# Altium schematic sheet MainBoard_Box.SchDoc
size A3; SheetNumber: 1; SheetTotal: 1
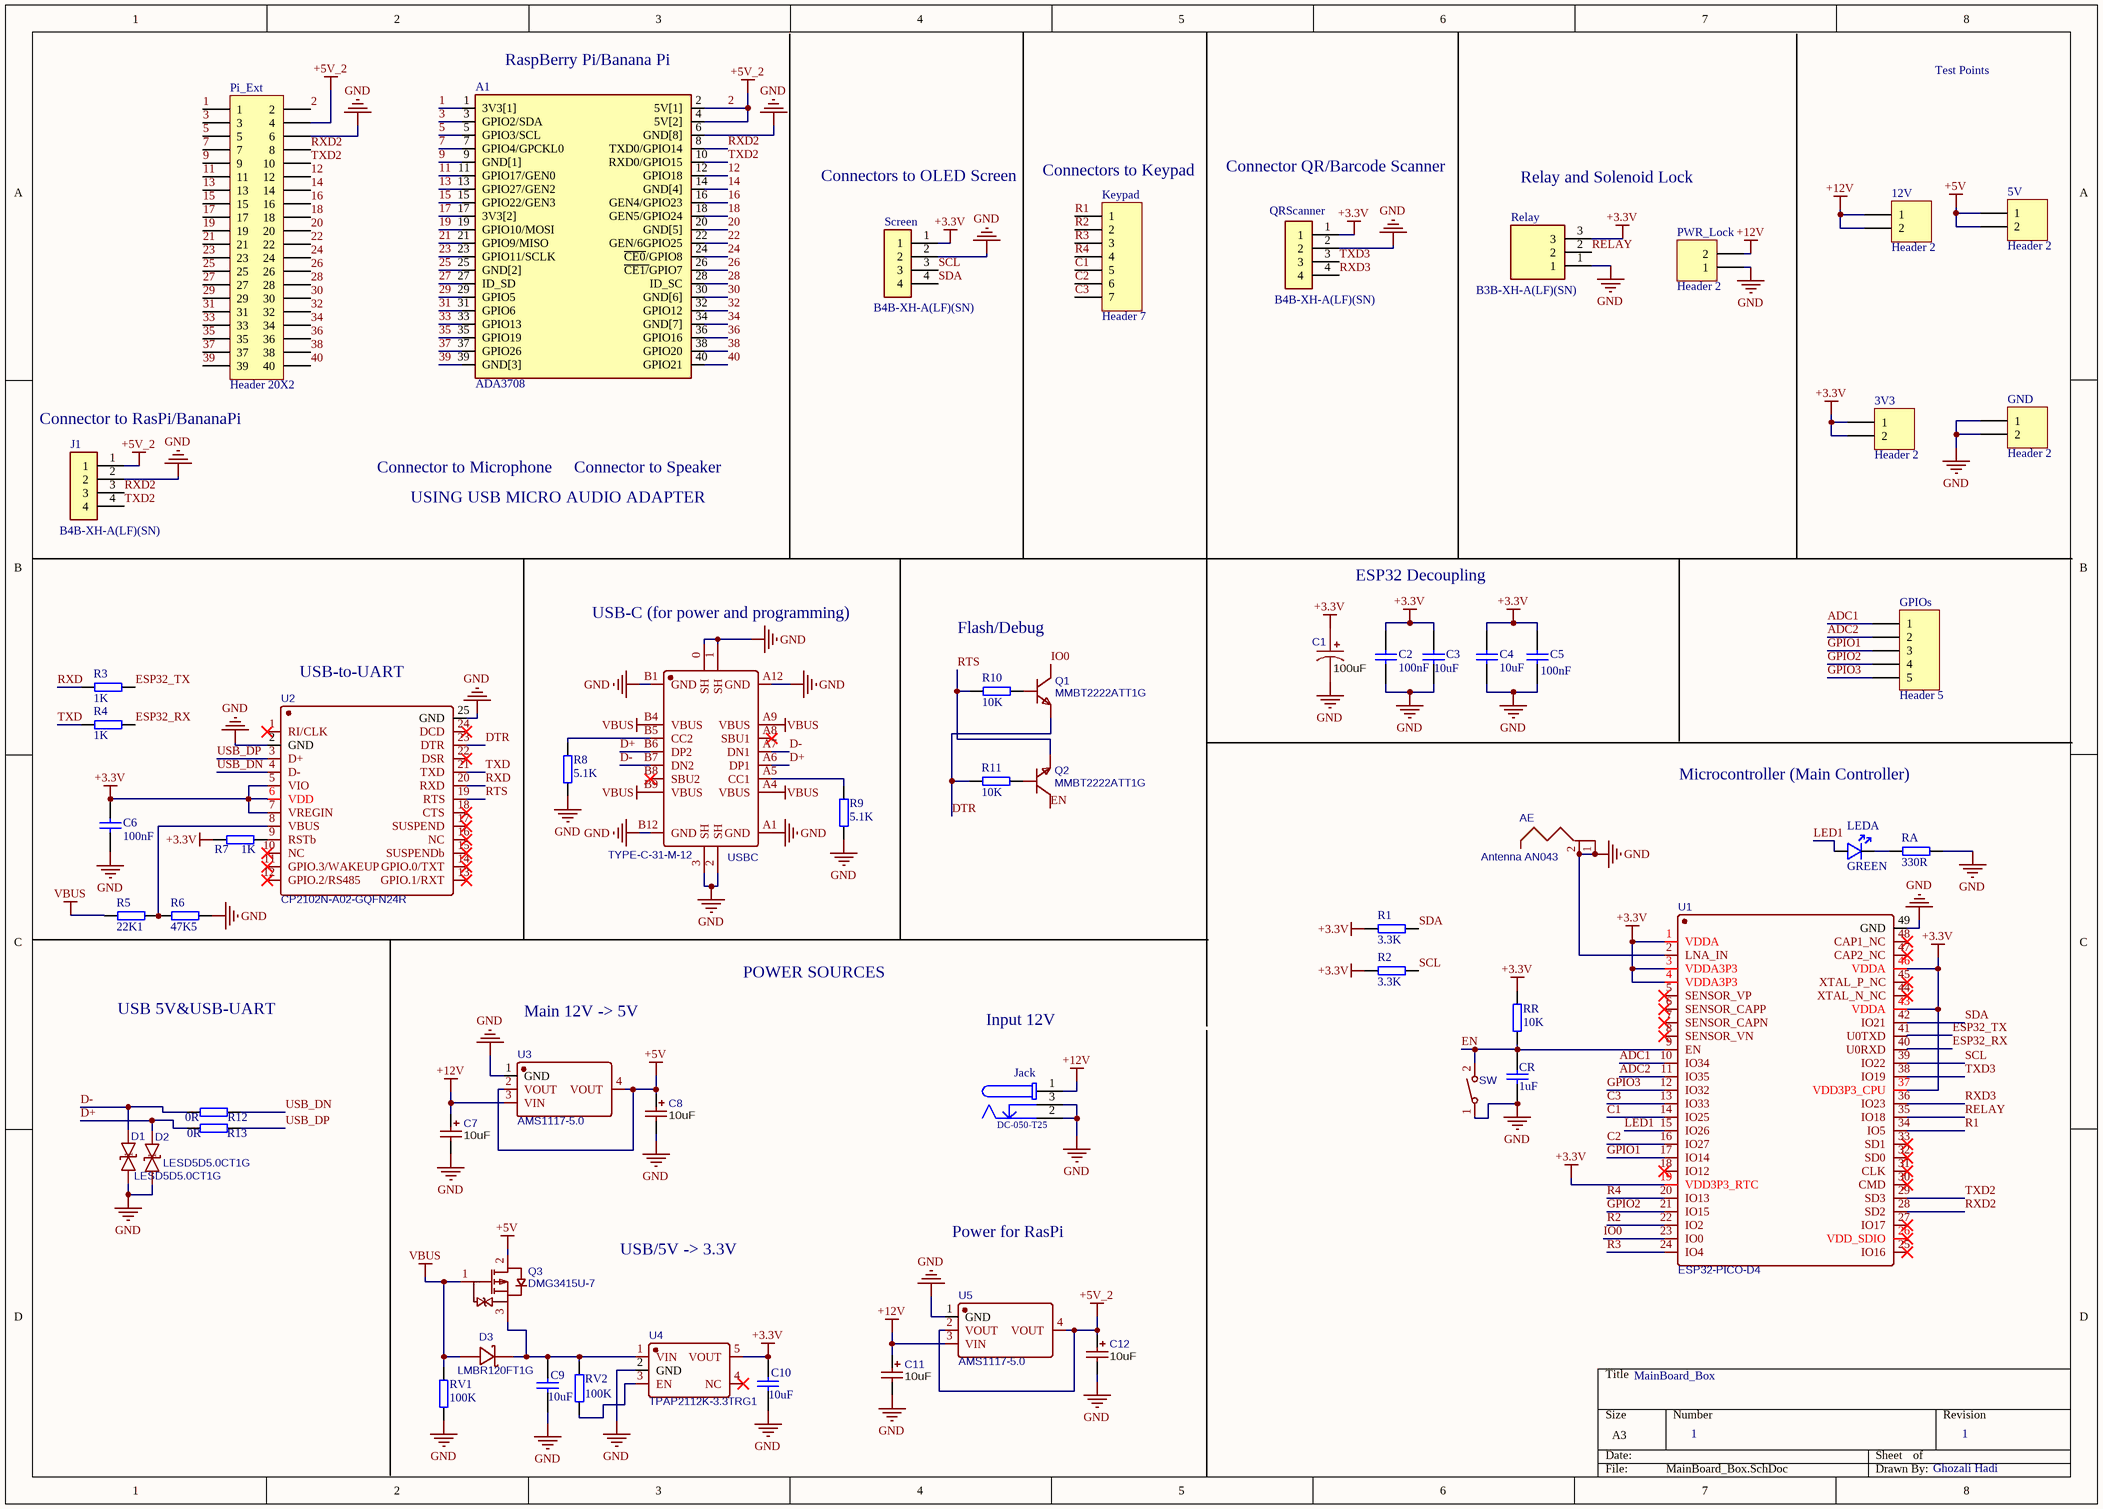
[diagram p0: MainBoard_Box.SchDoc]

## Parts
3V3  Header 2  [HDR1X2]
5V  Header 2  [HDR1X2]
12V  Header 2  [HDR1X2]
A1  ADA3708  [ADA3708_RPI-ZERO]
AE  Antenna AN043  [AN043]
C1  value 100uF  [CASE-C_6032]  (hidden comment: CA45-C-10V-100μF-K)
C2  value 100nF  [CAP0402]  (hidden comment: CC0402KRX7R7BB104)
C3  value 10uF  [CAP0402]  (hidden comment: CL05A106MQ5NUNC)
C4  value 10uF  [CAP0402]  (hidden comment: CL05A106MQ5NUNC)
C5  value 100nF  [CAP0402]  (hidden comment: CC0402KRX7R7BB104)
C6  value 100nF  [CAP0402]  (hidden comment: CC0402KRX7R7BB104)
C7  value 10uF  [CAP-SMD_L3.2-W1.6-R-RD]  (hidden comment: TAJA106K016RNJ)
C8  value 10uF  [CAP-SMD_L3.2-W1.6-R-RD]  (hidden comment: TAJA106K016RNJ)
C9  value 10uF  [CAP0402]  (hidden comment: CL05A106MQ5NUNC)
C10  value 10uF  [CAP0402]  (hidden comment: CL05A106MQ5NUNC)
C11  value 10uF  [CAP-SMD_L3.2-W1.6-R-RD]  (hidden comment: TAJA106K016RNJ)
C12  value 10uF  [CAP-SMD_L3.2-W1.6-R-RD]  (hidden comment: TAJA106K016RNJ)
CR  value 1uF  [CAP0402]  (hidden comment: CL05A105KA5NQNC)
D1  LESD5D5.0CT1G  [SOD-523_L1.2-W0.8-LS1.6-BI]
D2  LESD5D5.0CT1G  [SOD-523_L1.2-W0.8-LS1.6-BI]
D3  LMBR120FT1G  [SOD-123_L2.8-W1.8-LS3.7-RD]
GND  Header 2  [HDR1X2]
GPIOs  Header 5  [HDR1X5]
J1  B4B-XH-A(LF)(SN)  [JST_B4B-XH-A(LF)(SN)]
Jack  DC-050-T25  [694108106102]
Keypad  Header 7  [HDR1X7]
LEDA  value GREEN  [LED0603P]  (hidden comment: 19-217/GHC-YR1S2/3T)
Pi_Ext  Header 20X2  [HDR2X20]
PWR_Lock  Header 2  [HDR1X2]
Q1  MMBT2222ATT1G  [SC-75-3_L1.6-W0.8-P1.00-LS1.6-BR]
Q2  MMBT2222ATT1G  [SC-75-3_L1.6-W0.8-P1.00-LS1.6-BR]
Q3  DMG3415U-7  [SOT-23-3_L2.9-W1.6-P1.90-LS2.8-BR-CW]
QRScanner  B4B-XH-A(LF)(SN)  [JST_B4B-XH-A(LF)(SN)]
R1  value 3.3K  [RES0402]  (hidden comment: RC0402FR-073K3L)
R2  value 3.3K  [RES0402]  (hidden comment: RC0402FR-073K3L)
R3  value 1K  [RES0402]  (hidden comment: 0402WGF1001TCE)
R4  value 1K  [RES0402]  (hidden comment: 0402WGF1001TCE)
R5  value 22K1  [RES0402]  (hidden comment: 0402WGF2212TCE)
R6  value 47K5  [RES0402]  (hidden comment: 0402WGF4752TCE)
R7  value 1K  [RES0402]  (hidden comment: 0402WGF1001TCE)
R8  value 5.1K  [RES0402]  (hidden comment: RC0402JR-075K1L)
R9  value 5.1K  [RES0402]  (hidden comment: RC0402JR-075K1L)
R10  value 10K  [RES0402]  (hidden comment: 0402WGF1002TCE)
R11  value 10K  [RES0402]  (hidden comment: 0402WGF1002TCE)
R12  value 0R  [RES0402]  (hidden comment: RC0402FR-070RL)
R13  value 0R  [RES0402]  (hidden comment: RC0402FR-070RL)
RA  value 330R  [RES0402]  (hidden comment: 0402WGF3300TCE)
Relay  B3B-XH-A(LF)(SN)  [JST_B3B-XH-A(LF)(SN)]
RR  value 10K  [RES0402]  (hidden comment: 0402WGF1002TCE)
RV1  value 100K  [RES0402]  (hidden comment: RC0402FR-07100KL)
RV2  value 100K  [RES0402]  (hidden comment: RC0402FR-07100KL)
Screen  B4B-XH-A(LF)(SN)  [JST_B4B-XH-A(LF)(SN)]
SW  TS-1092S-B3D2-G  [SW-SMD_L6.1-W3.6-LS7.9]  (value not drawn)
U1  ESP32-PICO-D4  [QFN-48_L7.0-W7.0-P0.50-BL-EP5.4]
U2  CP2102N-A02-GQFN24R  [QFN-24_L4.0-W4.0-P0.50-TL-EP2.6]
U3  AMS1117-5.0  [SOT-223_L6.5-W3.5-P2.30-LS7.0-BR]
U4  TPAP2112K-3.3TRG1  [SOT-23-5_L2.9-W1.6-P0.95-LS2.8-BR]
U5  AMS1117-5.0  [SOT-223_L6.5-W3.5-P2.30-LS7.0-BR]
USBC  TYPE-C-31-M-12  [USB-C_SMD-TYPE-C-31-M-12]

## Nets
2: A1.2(5V[1]) A1.4(5V[2]) C12.1 J1.1 Pi_Ext.2 Pi_Ext.4 U5.2(VOUT) U5.4(VOUT)  [also labelled +5V_2]
+3.3V: 3V3.1 3V3.2 C1.1 C2.2 C3.2 C4.2 C5.2 C6.2 C10.2 QRScanner.1 R1.1 R2.1 R7.2 Relay.3 RR.1 Screen.1 U1.1(VDDA) U1.3(VDDA3P3) U1.4(VDDA3P3) U1.19(VDD3P3_RTC) U1.37(VDD3P3_CPU) U1.43(VDDA) U1.46(VDDA) U2.5(VIO) U2.6(VDD) U2.7(VREGIN) U4.5(VOUT)
+5V: 5V.1 5V.2 C8.1 Q3.2(D) U3.2(VOUT) U3.4(VOUT)
+12V: 12V.1 12V.2 C7.1 C11.1 Jack.1 PWR_Lock.2 U3.3(VIN) U5.3(VIN)
GND: A1.6(GND[8]) AE.1(ANT) AE.2 C1.2 C2.1 C3.1 C4.1 C5.1 C6.1 C7.2 C8.2 C9.1 C10.1 C11.2 C12.2 CR.1 D1.2 D2.2 GND.1 GND.2 J1.2 Jack.2 Jack.3 Pi_Ext.6 PWR_Lock.1 QRScanner.2 R6.2 R8.2 R9.2 RA.1 Relay.1 RV1.1 Screen.2 SW.1 U1.2(LNA_IN) U1.49(GND) U2.2(GND) U2.25(GND) U3.1(GND) U4.2(GND) U5.1(GND) USBC.0(SH) USBC.1(SH) USBC.2(SH) USBC.3(SH) USBC.A1(GND) USBC.A12(GND) USBC.B1(GND) USBC.B12(GND)
VBUS: D3.2(A) Q3.1(G) R5.1 RV1.2 USBC.A4(VBUS) USBC.A9(VBUS) USBC.B4(VBUS) USBC.B9(VBUS)
1: A1.1(3V3[1]) Pi_Ext.1
3: A1.3(GPIO2/SDA) Pi_Ext.3
5: A1.5(GPIO3/SCL) Pi_Ext.5
7: A1.7(GPIO4/GPCKL0) Pi_Ext.7
9: A1.9(GND[1]) Pi_Ext.9
11: A1.11(GPIO17/GEN0) Pi_Ext.11
12: A1.12(GPIO18) Pi_Ext.12
13: A1.13(GPIO27/GEN2) Pi_Ext.13
14: A1.14(GND[4]) Pi_Ext.14
15: A1.15(GPIO22/GEN3) Pi_Ext.15
16: A1.16(GEN4/GPIO23) Pi_Ext.16
17: A1.17(3V3[2]) Pi_Ext.17
18: A1.18(GEN5/GPIO24) Pi_Ext.18
19: A1.19(GPIO10/MOSI) Pi_Ext.19
20: A1.20(GND[5]) Pi_Ext.20
21: A1.21(GPIO9/MISO) Pi_Ext.21
22: A1.22(GEN/6GPIO25) Pi_Ext.22
23: A1.23(GPIO11/SCLK) Pi_Ext.23
24: A1.24(~{CE0}/GPIO8) Pi_Ext.24
25: A1.25(GND[2]) Pi_Ext.25
26: A1.26(~{CE1/}GPIO7) Pi_Ext.26
27: A1.27(ID_SD) Pi_Ext.27
28: A1.28(ID_SC) Pi_Ext.28
29: A1.29(GPIO5) Pi_Ext.29
30: A1.30(GND[6]) Pi_Ext.30
31: A1.31(GPIO6) Pi_Ext.31
32: A1.32(GPIO12) Pi_Ext.32
33: A1.33(GPIO13) Pi_Ext.33
34: A1.34(GND[7]) Pi_Ext.34
35: A1.35(GPIO19) Pi_Ext.35
36: A1.36(GPIO16) Pi_Ext.36
37: A1.37(GPIO26) Pi_Ext.37
38: A1.38(GPIO20) Pi_Ext.38
39: A1.39(GND[3]) Pi_Ext.39
40: A1.40(GPIO21) Pi_Ext.40
ADC1: GPIOs.1 U1.10(IO34)
ADC2: GPIOs.2 U1.11(IO35)
C1: Keypad.5 U1.14(IO25)
C2: Keypad.6 U1.16(IO27)
C3: Keypad.7 U1.13(IO33)
D+: D2.1 R13.2 USBC.A6(DP1) USBC.B6(DP2)
D-: D1.1 R12.2 USBC.A7(DN1) USBC.B7(DN2)
DTR: Q1.2(E) R11.1 U2.23(DTR)
EN: CR.2 Q2.3(C) RR.2 SW.2 U1.9(EN)
ESP32_RX: R4.1 U1.40(U0RXD)
ESP32_TX: R3.1 U1.41(U0TXD)
GPIO1: GPIOs.3 U1.17(IO14)
GPIO2: GPIOs.4 U1.21(IO15)
GPIO3: GPIOs.5 U1.12(IO32)
IO0: Q1.3(C) U1.23(IO0)
LED1: LEDA.1 U1.15(IO26)
R1: Keypad.1 U1.34(IO5)
R2: Keypad.2 U1.22(IO2)
R3: Keypad.3 U1.24(IO4)
R4: Keypad.4 U1.20(IO13)
RELAY: Relay.2 U1.35(IO18)
RTS: Q2.2(E) R10.1 U2.19(RTS)
RXD: R3.2 U2.20(RXD)
RXD2: A1.8(TXD0/GPIO14) J1.3 Pi_Ext.8 U1.28(SD2)
RXD3: QRScanner.4 U1.36(IO23)
SCL: R2.2 Screen.3 U1.39(IO22)
SDA: R1.2 Screen.4 U1.42(IO21)
TXD: R4.2 U2.21(TXD)
TXD2: A1.10(RXD0/GPIO15) J1.4 Pi_Ext.10 U1.29(SD3)
TXD3: QRScanner.3 U1.38(IO19)
USB_DN: R12.1 U2.4(D-)
USB_DP: R13.1 U2.3(D+)
NetC9_2: C9.2 D3.1(K) Q3.3(S) RV2.2 U4.1(VIN)
NetLEDA_2: LEDA.2 RA.2
NetQ1_1: Q1.1(B) R10.2
NetQ2_1: Q2.1(B) R11.2
NetR5_2: R5.2 R6.1 U2.8(VBUS)
NetR7_1: R7.1 U2.9(RSTb)
NetR8_1: R8.1 USBC.B5(CC2)
NetR9_1: R9.1 USBC.A5(CC1)
NetRV2_1: RV2.1 U4.3(EN)

Not connected (* = marked no-connect by the designer): U1 5(SENSOR_VP)* 6(SENSOR_CAPP)* 7(SENSOR_CAPN)* 8(SENSOR_VN)* 18(IO12)* 25(IO16)* 26(VDD_SDIO)* 27(IO17)* 30(CMD)* 31(CLK)* 32(SD0)* 33(SD1)* 44(XTAL_N_NC)* 45(XTAL_P_NC)* 47(CAP2_NC)* 48(CAP1_NC)*; U2 1(RI/CLK)* 10(NC)* 11(GPIO.3/WAKEUP)* 12(GPIO.2/RS485)* 13(GPIO.1/RXT)* 14(GPIO.0/TXT)* 15(SUSPENDb)* 16(NC)* 17(SUSPEND)* 18(CTS)* 22(DSR)* 24(DCD)*; U4 4(NC)*; USBC A8(SBU1)* B8(SBU2)*

## Notes on the sheet
- (near A1) RaspBerry Pi/Banana Pi
- Test Points
- Connectors to OLED Screen
- (near Keypad) Connectors to Keypad
- Connector QR/Barcode Scanner
- Relay and Solenoid Lock
- Connector to RasPi/BananaPi
- Connector to Microphone
- USING USB MICRO AUDIO ADAPTER
- Connector to Speaker
- ESP32 Decoupling
- (near USBC) USB-C (for power and programming)
- Flash/Debug
- (near U2) USB-to-UART
- Microcontroller (Main Controller)
- POWER SOURCES
- USB 5V&USB-UART
- Main 12V -> 5V
- Input 12V
- USB/5V -> 3.3V
- Power for RasPi
- MainBoard_Box
- 1
- Ghozali Hadi

## Library data of the parts
3V3 5V 12V GND PWR_Lock = Header 2: Header, 2-Pin; LatestRevisionDate: 17-Jul-2002; LatestRevisionNote: Re-released for DXP Platform.; Publisher: Altium Limited
A1 = ADA3708: Raspberry Pi Zero WH (Zero W with Headers); MP: ADA3708; Availability: Unavailable; Package: None; Value: *; Price: None
AE = Antenna AN043: Small Size 2.4 GHz PCB antenna; MF: Texas Instruments; MP: AN043
C1 = Cap_100uF: 100uF 10V -55℃~+125℃ 300mΩ@100kHz ±10% CASE-C_6032 Tantalum Capacitors; MF: TORCH; JLCPCB Part #: C171664; MP: CA45-C-10V-100μF-K; Package: CASE-C-6032
C2 C5 C6 = CAP-SM-0402-X7R-100NF: 16V 100nF X7R ±10% 0402 Multilayer Ceramic Capacitors MLCC; MF: YAGEO; MP: CC0402KRX7R7BB104; Package: 0402; LCSC Part #: C60474
C3 C4 C9 C10 = CAP-SM-0402-X5R-10UF: 6.3V 10uF X5R ±20% 0402 Multilayer Ceramic Capacitors MLCC; MF: SAMSUNG; MP: CL05A106MQ5NUNC; Package: 0402; LCSC Part #: C15525
C7 C8 C11 C12 = TAJA106K016RNJ: TANTALUM CAPACITORS 10UF 16V CASE-A_3216; MF: AVX; SMT Type: Basic; LCSC Part #: C7171; MP: TAJA106K016RNJ; BOM_Supplier Part: LCSC; Package: CASE-A_3216
CR = CAP-SM-0402-X5R-1UF: MULTILAYER CERAMIC CAPACITORS MLCC - SMD/SMT 1UF 25V 0402; Manufacturer: Samsung Electro-Mechanics; Part Number: CL05A105KA5NQNC; Package: 0402; LCSC Part #: C52923
D1 D2 = LESD5D5.0CT1G: 18.6V 9.4A (8/20us) 5V Bidirectional 5.6V SOD-523 ESD Protection Devices; MF: Leshan Radio; LCSC Part #: C383211; MP: LESD5D5.0CT1G; Package: SOD-523
D3 = LMBR120FT1G: 20V 500mV@1A 1A SOD-123 Schottky Barrier Diodes (SBD); MF: LRC; MP: LMBR120FT1G; JLCPCB Part #: C81143; Package: SOD-123
GPIOs = Header 5: Header, 5-Pin; LatestRevisionDate: 17-Jul-2002; LatestRevisionNote: Re-released for DXP Platform.; Publisher: Altium Limited
J1 QRScanner Screen = B4B-XH-A(LF)(SN): Connector Header Through Hole 4 position 0.098 _2.50mm_; MP: B4B-XH-A_LF__SN_; MF: JST Sales; Price: None; Package: None; Value: *; Availability: Unavailable; SnapEDA_Link: https://www.snapeda.com/parts/B4B-XH-A%28LF%29%28SN%29/JST%20Sales%20America%20Inc./view-part/447494/?ref=snap
Jack = DC Jack SMD: 3A 12V SMD AC/DC Power Connectors; MF: SOFNG; ComponentLink1Description: Manufacturer; ComponentLink1URL: http://www.we-online.de; ComponentLink2Description: Datasheet; ComponentLink2URL: http://katalog.we-online.de/em/datasheet/6941xx106102.pdf; MP: DC-050-T25; Package: SMD; JLCPCB Part #: C113716
Keypad = Header 7: Header, 7-Pin; LatestRevisionDate: 17-Jul-2002; LatestRevisionNote: Re-released for DXP Platform.; Publisher: Altium Limited
LEDA = LED-0603-RED: LIGHT EMITTING DIODES (LED) GREEN 520~535NM 112~258MCD@20MA TOP VIEW 0603; Manufacturer: Everlight Elec; Part Number: 19-217/GHC-YR1S2/3T; Package: 0603; JLCPCB Part #: C72043
Pi_Ext = Header 20X2: Header, 20-Pin, Dual row; LatestRevisionDate: 17-Jul-2002; LatestRevisionNote: Re-released for DXP Platform.; Publisher: Altium Limited
Q1 Q2 = MMBT2222ATT1G: NPN 600mA 40V 150mW SC-75(SOT-523) Transistors (NPN/PNP); MF: ON Semiconductor; Supplier: LCSC; MP: MMBT2222ATT1G; LCSC Part #: C94417; Package: SC-75(SOT-523)
Q3 = DMG3415U-7: SOT-23-3 MOSFETs; MF: VBsemi Elec; MP: DMG3415U-7-VB; Package: SOT-23-3; JLCPCB Part #: C709946
R1 R2 = RES-SM-0402-10K: 62.5mW Thick Film Resistors 50V ±100ppm/℃ ±1% -55℃~+155℃ 3.3kΩ 0402 Chip Resistor - Surface Mount; MF: YAGEO; MP: RC0402FR-073K3L; Package: 0402; JLCPCB Part #: C137992
R3 R4 R7 = RES-SM-0402-1K: ±1% 1/16W Thick Film Resistors 50V ±100ppm/℃ -55℃~+155℃ 1kΩ 0402 Chip Resistor; MF: UNI-ROYAL(Uniroyal Elec); MP: 0402WGF1001TCE; Package: 0402; LCSC Part #: C11702
R5 = RES-SM-0402-1K: ±1% 1/16W Thick Film Resistors 50V ±100ppm/℃ -55℃~+155℃ 22.1kΩ 0402 Chip Resistor - Surface Mount; MF: UNI-ROYAL(Uniroyal Elec); MP: 0402WGF2212TCE; Package: 0402; LCSC Part #: C43473
R6 = RES-SM-0402-1K: ±1% 1/16W Thick Film Resistors 50V ±100ppm/℃ -55℃~+155℃ 47.5kΩ 0402 Chip Resistor - Surface Mount; MF: UNI-ROYAL(Uniroyal Elec); MP: 0402WGF4752TCE; Package: 0402; LCSC Part #: C25896
R8 R9 = RES-SM-0402-10K: 5.1kΩ 0402 1/16W 50V ±5% ±100ppm/℃  Chip Resistor - Surface Mount; MF: YAGEO; MP: RC0402JR-075K1L; Package: 0402; LCSC Part #: C105873
R10 R11 RR = RES-SM-0402-10K: CHIP RESISTOR - SURFACE MOUNT 10KOHMS ±1% 1/16W 0402; MF: Uniroyal Elec; MP: 0402WGF1002TCE; Package: 0402; LCSC Part #: C25744
R12 R13 = RES-SM-0402-0R: 1/16W ±1% 0Ω 0402 Chip Resistor; MF: YAGEO; MP: RC0402FR-070RL; Package: 0402; LCSC Part #: C106231
RA = RES-SM-0402-220R: CHIP RESISTOR - SURFACE MOUNT 330OHMS ±1% 1/16W 0402; Manufacturer: Uniroyal Elec; Part Number: 0402WGF3300TCE; Package: 0402; LCSC Part #: C25104
Relay = B3B-XH-A(LF)(SN): Connector Header Through Hole 3 position 0.098 (2.50mm); MF: JST Sales; Package: None; SnapEDA_Link: https://www.snapeda.com/parts/B3B-XH-A(LF)(SN)/JST%20Sales%20America%20Inc./view-part/231271/?ref=snap; DigiKey-Purchase-URL: https://snapeda.com/shop?store=DigiKey&id=231271; MP: B3B-XH-A(LF)(SN); Price: None; Availability: Warning; Value: *
RV1 RV2 = RES-SM-0402-1K: 62.5mW Thick Film Resistors 50V ±100ppm/℃ ±1% -55℃~+155℃ 100kΩ 0402 Chip Resistor - Surface Mount; MF: YAGEO; MP: RC0402FR-07100KL; Package: 0402; LCSC Part #: C60491
SW = TS-1092S-B3D2-G: NO 3.6mm 2.5mm Gull Wing Gray Rectangle button Brick nogging SPST 6.1mm 250gf@±30gf SMD Tactile Switches; MF: Yuandi; JLCPCB Part #: C520860; MP: TS-1092S-B3D2-G; Package: SMD
U1 = ESP32-PICO-D4: QFN-48_7x7x05P RF Transceiver ICs; MF: Espressif Systems; LCSC Part #: C193707; MP: ESP32-PICO-D4
U2 = CP2102N-A02-GQFN24R: QFN-24_4x4x05P USB ICs; MF: SILICON LABS; LCSC Part #: C969151; MP: CP2102N-A02-GQFN24R; Package: QFN-24_4x4x05P
U3 U5 = AMS1117-5.0: 68dB@(120Hz) 1A 1.3V@(1A) Fixed 5V~5V Positive 1 15V SOT-223 Linear Voltage Regulators (LDO); MF: AMS; MP: AMS1117-5.0; JLCPCB Part #: C6187; Package: SOT-223
U4 = TPAP2112K-3.3TRG1: SOT-23-5 Linear Voltage Regulators (LDO); MF: TECH PUBLIC; JLCPCB Part #: C3021085; MP: TPAP2112K-3.3TRG1; Package: SOT-23-5
USBC = TYPE-C-31-M-12: 5A 1 16 Female Type-C SMD USB Connectors; MF: Korean Hroparts Elec; JLCPCB Part #: C165948; MP: TYPE-C-31-M-12; Package: SMD